# EAGLE design ftdi (EAGLE 6.4)
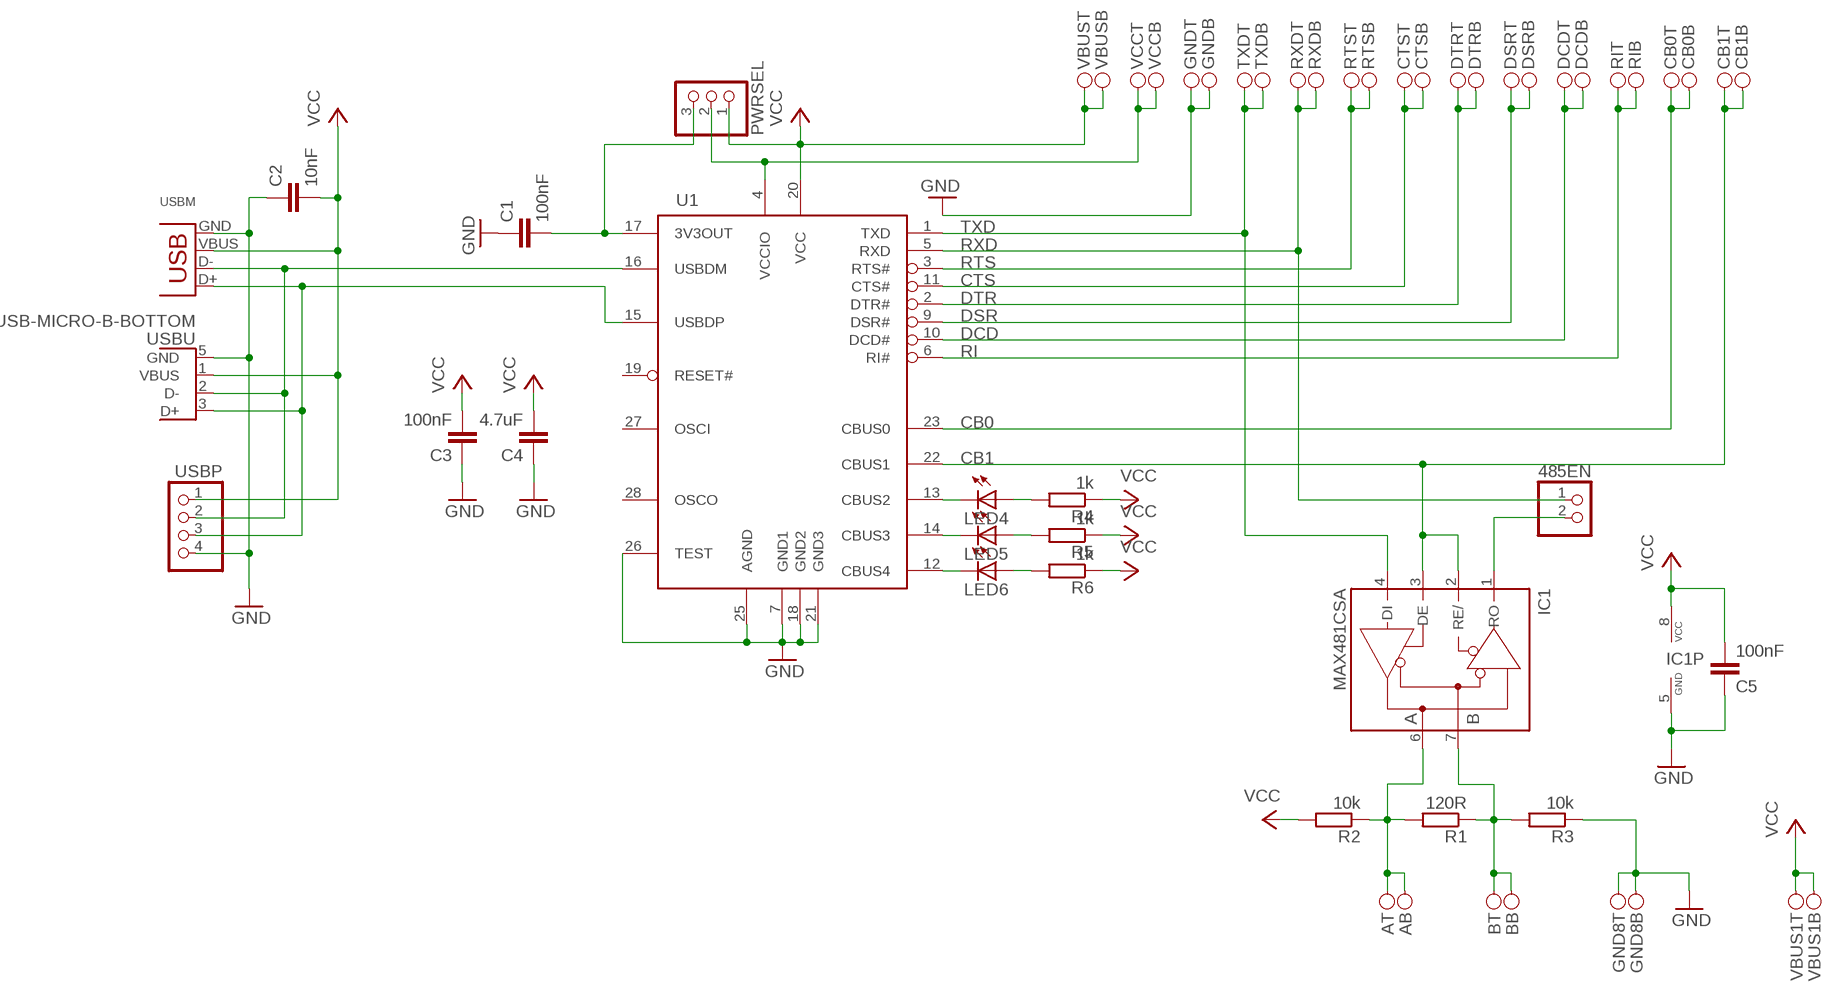
[diagram p0: schematic, sheet 1]

## Parts
485EN  PINHD-1X2/90  [1X02/90]
A  PINH2X01  [PINH2X01SMD]
B  PINH2X01  [PINH2X01SMD]
C1  100nF  C-EUC0402  [C0402]
C2  10nF  C-EUC0603  [C0603]
C3  100nF  C-EUC0402  [C0402]
C4  4.7uF  C-EUC0805K  [C0805K]
C5  100nF  C-EUC0402  [C0402]
CB0  PINH2X01  [PINH2X01SMD]
CB1  PINH2X01  [PINH2X01SMD]
CTS  PINH2X01  [PINH2X01SMD]
DCD  PINH2X01  [PINH2X01SMD]
DSR  PINH2X01  [PINH2X01SMD]
DTR  PINH2X01  [PINH2X01SMD]
GND  PINH2X01  [PINH2X01SMD]
GND8  PINH2X01  [PINH2X01SMD]
IC1  MAX481CSA  [SO08]
LED4  LEDCHIPLED_0603  [CHIPLED_0603]
LED5  LEDCHIPLED_0603  [CHIPLED_0603]
LED6  LEDCHIPLED_0603  [CHIPLED_0603]
PWRSEL  PINHD-1X3/90  [1X03/90]
R1  120R  R-EU_R0603  [R0603]
R2  10k  R-EU_R0603  [R0603]
R3  10k  R-EU_R0603  [R0603]
R4  1k  R-EU_R0603  [R0603]
R5  1k  R-EU_R0603  [R0603]
R6  1k  R-EU_R0603  [R0603]
RI  PINH2X01  [PINH2X01SMD]
RTS  PINH2X01  [PINH2X01SMD]
RXD  PINH2X01  [PINH2X01SMD]
TXD  PINH2X01  [PINH2X01SMD]
U1  FT232RL  [SSOP28DB]
USBM  USB-MB-S  [USB-MB-S]
USBP  PINHD-1X4  [1X04]
USBU  USB-MICRO-B-BOTTOM  [USB-MICRO-B-BOTTOM-MOLEX]
VBUS  PINH2X01  [PINH2X01SMD]
VBUS1  PINH2X01  [PINH2X01SMD]
VCC  PINH2X01  [PINH2X01SMD]

## Nets
3V3: C1.2 PWRSEL.3 U1.17(3V3OUT)
A: A.1 A.2 IC1.6(A) R1.2 R2.1
B: B.1 B.2 IC1.7(B) R1.1 R3.2
CB0: CB0.1 CB0.2 U1.23(CBUS0)
CB1: CB1.1 CB1.2 IC1.2(RE/) IC1.3(DE) U1.22(CBUS1)
CB2_: LED4.A R4.2
CB3_: LED5.A R5.2
CB4_: LED6.A R6.2
CBUS2_: LED4.C U1.13(CBUS2)
CBUS3_: LED5.C U1.14(CBUS3)
CBUS4_: LED6.C U1.12(CBUS4)
CTS: CTS.1 CTS.2 U1.11(CTS#)
DCD: DCD.1 DCD.2 U1.10(DCD#)
DSR: DSR.1 DSR.2 U1.9(DSR#)
DTR: DTR.1 DTR.2 U1.2(DTR#)
GND: C1.1 C2.1 C3.1 C4.1 C5.1 GND8.1 GND8.2 GND.1 GND.2 IC1.5(GND) R3.1 U1.7(GND1) U1.18(GND2) U1.21(GND3) U1.25(AGND) U1.26(TEST) USBM.GND USBP.4 USBU.5(GND)
RI: RI.1 RI.2 U1.6(RI#)
RO: 485EN.2 IC1.1(RO)
RTS: RTS.1 RTS.2 U1.3(RTS#)
RXD: 485EN.1 RXD.1 RXD.2 U1.5(RXD)
TXD: IC1.4(DI) TXD.1 TXD.2 U1.1(TXD)
USBDM: U1.16(USBDM) USBM.D- USBP.2 USBU.2(D-)
USBDP: U1.15(USBDP) USBM.D+ USBP.3 USBU.3(D+)
VCC: C2.2 C3.2 C4.2 C5.2 IC1.8(VCC) PWRSEL.1 R2.2 R4.1 R5.1 R6.1 U1.20(VCC) USBM.VBUS USBP.1 USBU.1(VBUS) VBUS1.1 VBUS1.2 VBUS.1 VBUS.2
VCCIO: PWRSEL.2 U1.4(VCCIO) VCC.1 VCC.2
Unconnected: U1.19(RESET#) U1.27(OSCI) U1.28(OSCO)

## Library data of the parts
485EN = pinhead:PINHD-1X2: PIN HEADER
A B CB0 CB1 CTS DCD DSR DTR GND GND8 RI RTS RXD TXD VBUS VBUS1 VCC = pinhead_smd:PINH2X01
C1-C5 = rcl_upravena:C-EU: CAPACITOR, European symbol
IC1 = maxim:MAX481CSA: RS485 TRANSEIVER; MF: MAXIM; MPN: MAX481CSA; OC_FARNELL: unknown; OC_NEWARK: 90C3817
LED4-LED6 = led:LED: LED OSRAM: - CHIPLED LG R971, LG N971, LY N971, LG Q971, LY Q971, LO R971, LY R971 LH N974, LH R974 LS Q976, LO Q976, LY Q976 LO Q996 - Hyper CHIPLED LW Q18S LB Q993, LB Q99A, LB R99A - SideLED LS A670, LO A670, LY A670, LG A670, LP A670 LB A673, LV A673, LT A673, LW A673 LH A674 LY A675 LS A676, LA A676, LO A676, LY A676, LW A676 LS A679, LY A679, LG A679 - Hyper Micro SIDELED® LS Y876, LA Y876, LO Y876, LY Y876 LT Y87S - SmartLED LW L88C, LW L88S LB L89C, LB L89S, LG L890 LS L89K, LO L89K, LY L89K LS L896, LA L896, LO L896, LY L896 - TOPLED LS T670, LO T670, LY T670, LG T670, LP T670 LSG T670, LSP T670, LSY T670, LOP T670, LYG T670 LG T671, LOG T671, LSG T671 LB T673, LV T673, LT T673, LW T673 LH T674 LS T676, LA T676, LO T676, LY T676, LB T676, LH T676, LSB T676, LW T676 LB T67C, LV T67C, LT T67C, LS T67K, LO T67K, LY T67K, LW E67C LS E67B, LA E67B, LO E67B, LY E67B, LB E67C, LV E67C, LT E67C LW T67C LS T679, LY T679, LG T679 LS T770, LO T770, LY T770, LG T770, LP T770 LB T773, LV T773, LT T773, LW T773 LH T774 LS E675, LA E675, LY E675, LS T675 LS T776, LA T776, LO T776, LY T776, LB T776 LHGB T686 LT T68C, LB T68C - Hyper Mini TOPLED® LB M676 - Mini TOPLED Santana® LG M470 LS M47K, LO M47K, LY M47K Source: http://www.osram.convergy.de LUXEON: - LUMILED® LXK2-PW12-R00, LXK2-PW12-S00, LXK2-PW14-U00, LXK2-PW14-V00 LXK2-PM12-R00, LXK2-PM12-S00, LXK2-PM14-U00 LXK2-PE12-Q00, LXK2-PE12-R00, LXK2-PE12-S00, LXK2-PE14-T00, LXK2-PE14-U00 LXK2-PB12-K00, LXK2-PB12-L00, LXK2-PB12-M00, LXK2-PB14-N00, LXK2-PB14-P00, LXK2-PB14-Q00 LXK2-PR12-L00, LXK2-PR12-M00, LXK2-PR14-Q00, LXK2-PR14-R00 LXK2-PD12-Q00, LXK2-PD12-R00, LXK2-PD12-S00 LXK2-PH12-R00, LXK2-PH12-S00 LXK2-PL12-P00, LXK2-PL12-Q00, LXK2-PL12-R00 Source: www.luxeon.com KINGBRIGHT: KA-3528ASYC Source: www.kingbright.com
PWRSEL = pinhead:PINHD-1X3: PIN HEADER
R1-R6 = rcl_upravena:R-EU_: RESISTOR, European symbol
U1 = ftdichip-3:FT232RL: USB UART 4th Generation USB UART (USB <-> Serial) Controller
USBM = con-usb-3:USB: USB Connectors
USBP = pinhead:PINHD-1X4: PIN HEADER
USBU = usb:USB

## Board
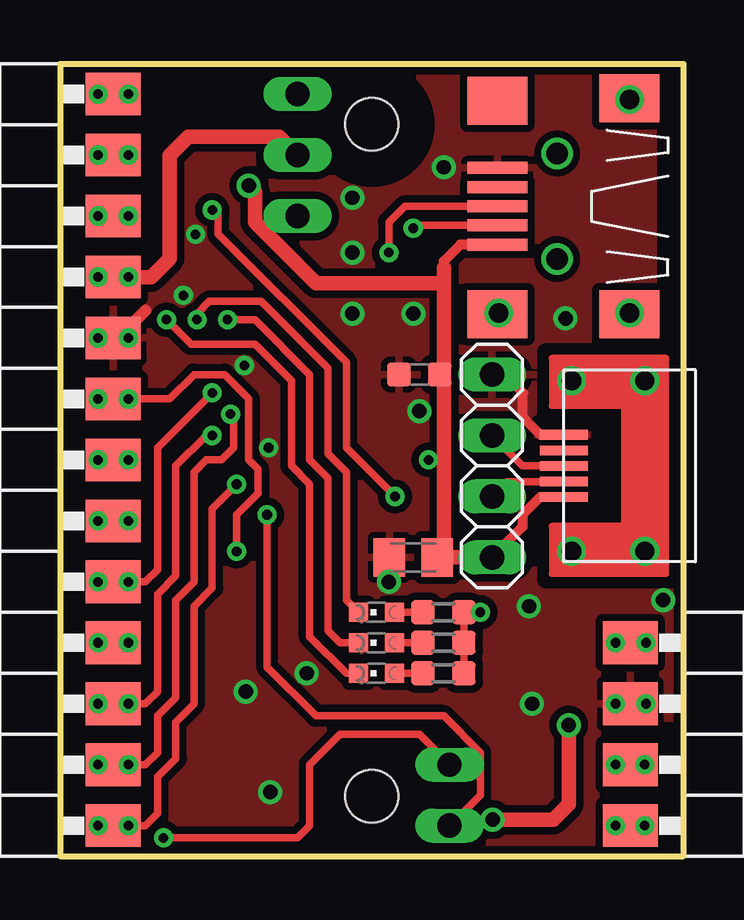
[diagram p1: board, top side]
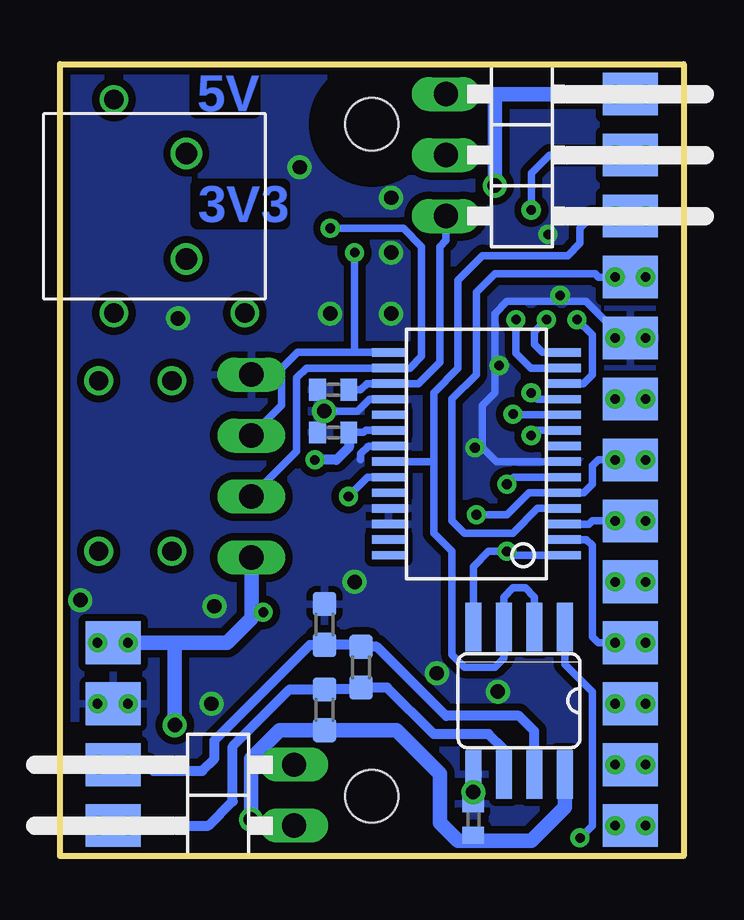
[diagram p2: board, bottom side, seen from below]

Size 26 x 33 mm. Coordinates in mm from the lower left corner, seen from the top.
Outline: 0,0 26,0 26,33 0,33 0,0
Copper layers (1*16): Top 0.035mm / dielectric 1.5mm / Bottom 0.035mm
Design rules "Design Rules - Vacha (3F) *": minimum track width 10mil, minimum drill 15mil, track to track 0.2mm, track to pad 0.2mm, pad to pad 0.2mm, via to via 0.2mm, smd to smd 0mil, copper to edge 0.15mm, drill to drill 8mil, minimum pad ring 0.2mm, minimum via ring 0.2mm, stop-mask expansion 2mil, vias tented up to drill 0.4mm, thermal gap 10mil
Holes 2.2 mm at 13,30.5 13,2.5
tRestrict: area 10.8,28.2 to 15.2,32.8; area 10.8,0.2 to 15.2,4.8; 2 lines
bRestrict: area 10.8,28.2 to 15.2,32.8; area 10.8,0.2 to 15.2,4.8; 1 lines

### Footprints (pad centres in the part's own frame; a part is rotated, then mirrored left to right if it is on the bottom)
1X02/90 = drill 1.016 long: 1 -1.27,-3.81; 2 1.27,-3.81
PINH2X01SMD = smd 1.778 x 2.286: 1 0,-2.223 | smd 1.778 x 2.286 bottom: 2 0,-2.223
C0402 = smd 0.7 x 0.9: 1 -0.65,0; 2 0.65,0
C0603 = smd 1 x 1: 1 -0.85,0; 2 0.85,0
C0805K = smd 1.3 x 1.6: 1 -1,0; 2 1,0
SO08 = smd 0.66 x 2.032: 1 -1.905,-3.073; 2 -0.635,-3.073; 3 0.635,-3.073; 4 1.905,-3.073; 5 1.905,3.073; 6 0.635,3.073; 7 -0.635,3.073; 8 -1.905,3.073
CHIPLED_0603 = smd 0.8 x 0.8: A 0,-0.75; C 0,0.75
1X03/90 = drill 1.016 long: 1 -2.54,-3.81; 2 0,-3.81; 3 2.54,-3.81
R0603 = smd 1 x 1: 1 -0.85,0; 2 0.85,0
SSOP28DB = smd 0.348 x 1.397: 1 -4.225,-3.656; 2 -3.575,-3.656; 3 -2.925,-3.656; 4 -2.275,-3.656; 5 -1.625,-3.656; 6 -0.975,-3.656; 7 -0.325,-3.656; 8 0.325,-3.656; 9 0.975,-3.656; 10 1.625,-3.656; 11 2.275,-3.656; 12 2.925,-3.656; 13 3.575,-3.656; 14 4.225,-3.656; 15 4.225,3.656; 16 3.575,3.656; 17 2.925,3.656; 18 2.275,3.656; 19 1.625,3.656; 20 0.975,3.656; 21 0.325,3.656; 22 -0.325,3.656; 23 -0.975,3.656; 24 -1.625,3.656; 25 -2.275,3.656; 26 -2.925,3.656; 27 -3.575,3.656; 28 -4.225,3.656
USB-MB-S = smd 2.5 x 0.5: D+ 2.5,0; D- 2.5,0.8; GND 2.5,-1.6; ID 2.5,-0.8; VBUS 2.5,1.6 | smd 2.5 x 2: P$1 -3,-4.5; P$2 -3,4.5; P$3 2.5,-4.4; P$4 2.5,4.5 | drill 0.9: P$5 0,2.2; P$6 0,-2.2
1X04 = drill 1.016 long: 1 -3.81,0; 2 -1.27,0; 3 1.27,0; 4 3.81,0
USB-MICRO-B-BOTTOM-MOLEX = smd 2 x 0.4: 1 5,1.3; 2 5,0.65; 3 5,0; 4 5,-0.65; 5 5,-1.3

### Placement (x,y rotation side)
485EN  20.05,2.54 90 bottom
A  26,1.27 270 top
B  26,3.81 270 top
C1  14.61,19.43 0 bottom
C2  14.99,20.07 0 top
C3  14.61,17.65 0 bottom
C4  14.73,12.45 0 top
C5  8.76,1.52 270 bottom
CB0  0,29.21 90 top
CB1  0,26.67 90 top
CTS  0,11.43 90 top
DCD  0,3.81 90 top
DSR  0,6.35 90 top
DTR  0,8.89 90 top
GND  0,21.59 90 top
GND8  26,6.35 270 top
IC1  6.86,6.48 180 bottom
LED4  13.19,8.89 90 top
LED5  13.19,10.16 90 top
LED6  13.19,7.62 90 top
PWRSEL  6.1,29.21 270 bottom
R1  13.45,7.87 270 bottom
R2  14.97,6.1 270 bottom
R3  14.97,9.65 270 bottom
R4  15.99,8.89 180 top
R5  15.99,10.16 180 top
R6  15.99,7.62 180 top
RI  0,1.27 90 top
RTS  0,13.97 90 top
RXD  0,16.51 90 top
TXD  0,19.05 90 top
U1  8.64,16.76 90 bottom
USBM  20.73,27.08 180 top
USBP  18.02,16.26 90 top
USBU  26,16.26 180 top
VBUS  0,31.75 90 top
VBUS1  26,8.89 270 top
VCC  0,24.13 90 top

### Tracks (layer width: path | path; a pad name or v marks a point on that pad's centre or on a via)
3V3
  Bottom 0.305: PWRSEL.3 9.91,25.65 10.16,25.4 10.16,20.57 11.04,19.69 U1.17 13.2,19.69 13.46,19.43 C1.2
A  (via drill 0.4)
  Top 0.305: A.2 v24.38,1.27
  Bottom 0.305: v23.16,1.27 A.2 v24.38,1.27
  Bottom 0.406: v23.16,1.27 19.81,1.27 18.8,2.29 18.8,4.57 16.42,6.95 R2.1 13.52,6.95 R1.2 12.36,7.02 10.41,5.08 8.13,5.08 7.49,4.45 IC1.6
B  (via drill 0.4)
  Top 0.305: v24.38,3.81 B.2
  Bottom 0.305: v24.38,3.81 B.2 v23.16,3.81
  Bottom 0.406: v23.16,3.81 22.35,3.81 22.1,3.56 20.07,3.56 19.56,4.06 19.56,4.83 15.58,8.8 R3.2 13.52,8.8 R1.1 12.79,8.72 9.91,5.84 6.86,5.84 6.22,5.21 IC1.7
CB0  (via drill 0.4)
  Top 0.305: v13.97,14.99 11.94,17.02 11.94,20.57 6.6,25.91 6.6,26.67 v6.35,26.92
  Top 0.406: CB0.2 v1.59,29.21 v2.86,29.21
  Bottom 0.305: v6.35,26.92 6.35,28.45 5.59,29.21 v2.86,29.21 | U1.23 13.17,15.79 v13.97,14.99
  Bottom 0.406: CB0.2 v1.59,29.21
CB1  (via drill 0.4)
  Top 0.406: CB1.2 v1.59,26.67 v2.86,26.67
  Bottom 0.305: 9.14,7.87 9.65,8.38 | 9.65,8.38 9.65,12.7 10.41,13.46 10.41,16.51 | 10.41,16.51 10.41,19.3 9.4,20.32 9.4,24 8.38,25.02 4.83,25.02 4.32,25.53 4.32,26.16 3.81,26.67 v2.86,26.67 | 9.14,7.87 7.87,7.87 7.49,8.26 IC1.3 7.49,10.79 7.11,11.18 6.6,11.18 6.22,10.79 IC1.2 | U1.22 10.41,16.44 10.41,16.51 | 9.14,7.87 9.65,8.38
  Bottom 0.406: v1.59,26.67 CB1.2
CB2_
  Top 0.305: LED4.A R4.2
CB3_
  Top 0.305: LED5.A R5.2
CB4_
  Top 0.305: LED6.A R6.2
CBUS2_  (via drill 0.4)
  Top 0.305: v6.99,22.35 8.13,22.35 10.41,20.07 10.41,16.51 11.18,15.75 11.18,10.92 11.18,9.4 11.68,8.89 LED4.C
  Bottom 0.305: U1.13 6.37,20.34 6.99,20.95 v6.99,22.35
CBUS3_  (via drill 0.4)
  Top 0.305: v5.71,22.35 5.71,22.61 6.22,23.11 8.38,23.11 11.18,20.32 11.18,16.76 11.94,16 11.94,11.18 11.94,10.66 LED5.C
  Bottom 0.305: U1.14 5.88,20.99 6.22,21.34 6.22,21.84 v5.71,22.35
CBUS4_  (via drill 0.4)
  Top 0.305: v4.45,22.35 5.46,21.34 8.13,21.34 9.65,19.81 9.65,16.26 10.41,15.49 10.41,10.67 10.41,9.14 11.94,7.62 LED6.C
  Bottom 0.305: v4.45,22.35 3.81,21.72 3.81,20.07 4.19,19.69 U1.12
CTS  (via drill 0.4)
  Top 0.305: v2.86,11.43 3.56,11.43 4.06,11.94 4.06,17.02 5.84,18.8 v6.35,19.3
  Top 0.406: CTS.2 v1.59,11.43 v2.86,11.43
  Bottom 0.305: v6.35,19.3 6.08,19.04 U1.11
  Bottom 0.406: CTS.2 v1.59,11.43
DCD  (via drill 0.4)
  Top 0.305: v2.86,3.81 3.56,3.81 4.06,4.32 4.06,5.84 4.83,6.6 4.83,10.67 5.59,11.43 5.59,16 6.1,16.51 6.73,16.51 7.24,17.02 7.24,18.29 v7.11,18.41
  Top 0.406: DCD.2 v1.59,3.81 v2.86,3.81
  Bottom 0.305: v7.11,18.41 7.14,18.39 U1.10
  Bottom 0.406: DCD.2 v1.59,3.81
DSR  (via drill 0.4)
  Top 0.305: v2.86,6.35 3.56,6.35 4.06,6.86 4.06,10.92 4.83,11.68 4.83,16.26 6.1,17.53 v6.35,17.53
  Top 0.406: DSR.2 v1.59,6.35 v2.86,6.35
  Bottom 0.305: v6.35,17.53 6.14,17.74 U1.9
  Bottom 0.406: DSR.2 v1.59,6.35
DTR  (via drill 0.4)
  Top 0.406: DTR.2 v1.59,8.89 v2.86,8.89
  Bottom 0.305: U1.2 4.04,13.19 3.81,12.95 3.81,9.14 3.56,8.89 v2.86,8.89
  Bottom 0.406: v1.59,8.89 DTR.2
GND  (via drill 0.4, 0.6)
  Top 0.406: USBU.5 20.04,17.56 19.3,18.29 19.3,19.3 18.54,20.07 USBP.4
  Top 0.508: 3.05,22.23 3.56,22.73
  Bottom 0.305: U1.7 7.8,16.44 8.38,17.02 8.38,18.8 7.87,19.3 7.87,22.61 7.37,23.11 4.06,23.11 3.05,22.1 3.05,21.78 v2.86,21.59 | U1.18 13.09,19.04 13.59,18.54 v14.99,18.54 | U1.21 13.14,17.09 13.46,16.76 13.46,16.51
  Bottom 0.61: C5.1 IC1.5
  other vias: 1.59,21.59 24.43,6.35 23.16,6.35 16,28.7 12.19,25.15 12.19,22.61 13.72,11.43 7.68,20.45 25.15,10.67 21.08,22.41 14.73,22.61 10.29,7.62 8.7,17.02 7.75,6.86 8.76,2.67 19.68,6.35 5.65,25.91 5.14,23.37 12.19,27.43 19.56,10.41
  pour Top (isolate 0.305): 1.27,0 1.27,33 26,33 26,0
  pour Bottom (isolate 0.305): 26,33 26,0 1.02,0 1.27,33
N$1  (via drill 0.8)
  other vias: 24.38,19.81
N$2  (via drill 0.8)
  other vias: 21.34,19.81
N$3  (via drill 0.8)
  other vias: 21.34,12.7
N$4  (via drill 0.8)
  other vias: 24.38,12.7
N$6  (via drill 0.8)
  other vias: 23.75,31.52
N$7  (via drill 0.8)
  other vias: 23.75,22.63
N$8  (via drill 0.8)
  other vias: 18.29,22.63
RI  (via drill 0.4)
  Top 0.305: v2.86,1.27 3.56,1.27 4.06,1.78 4.06,3.3 4.83,4.06 4.83,5.59 5.59,6.35 5.59,10.41 6.35,11.18 6.35,14.48 v7.37,15.49
  Top 0.406: v1.59,1.27 RI.2 v2.86,1.27
  Bottom 0.305: v7.37,15.49 7.07,15.79 U1.6
  Bottom 0.406: RI.2 v1.59,1.27
RO  (via drill 0.4)
  Top 0.305: 485EN.2 16.24,3.83 14.99,5.08 11.68,5.08 10.41,3.81 10.41,1.27 9.91,0.76 v4.32,0.76
  Bottom 0.305: IC1.1 4.95,8 3.81,6.86 3.81,1.27 v4.32,0.76
RTS  (via drill 0.4)
  Top 0.406: RTS.2 v1.59,13.97 v2.86,13.97
  Bottom 0.305: U1.3 3.94,13.84 3.81,13.97 v2.86,13.97
  Bottom 0.406: v1.59,13.97 RTS.2
RXD  (via drill 0.4)
  Top 0.305: 485EN.1 16.26,1.27 17.53,2.54 17.53,4.32 16,5.84 10.67,5.84 8.64,7.87 v8.64,14.22
  Top 0.406: v1.59,16.51 RXD.2 2.54,16.51 v2.86,16.51
  Bottom 0.305: v2.86,16.51 3.56,16.51 3.81,16.26 3.81,15.49 4.17,15.14 U1.5 6.45,15.14 7.37,14.22 v8.64,14.22
  Bottom 0.406: RXD.2 v1.59,16.51
TXD  (via drill 0.4)
  Top 0.305: v2.86,19.05 4.57,19.05 5.59,20.07 6.86,20.07 7.87,19.05 7.87,16.51 8.26,16.13 8.26,15.11 7.37,14.22 v7.37,12.7
  Top 0.406: TXD.2 v1.59,19.05 v2.86,19.05
  Bottom 0.305: U1.1 7.21,12.54 v7.37,12.7 8.13,12.7 8.76,12.06 IC1.4
  Bottom 0.406: v1.59,19.05 TXD.2
USBDM  (via drill 0.4)
  Top 0.305: USBU.2 18.64,15.61 USBP.2 | USBM.D- 14.85,26.28 v14.73,26.16
  Bottom 0.305: USBP.2 16.13,16.88 16.13,19.94 15.73,20.34 U1.16 11.41,20.34 10.92,20.83 10.92,25.4 11.68,26.16 v14.73,26.16
USBDP  (via drill 0.4)
  Top 0.305: USBU.3 19.29,16.26 USBP.3 | USBM.D+ 14.38,27.08 13.72,26.42 v13.72,25.15
  Bottom 0.305: USBP.3 18.02,17.54 16.76,18.8 16.76,20.32 16.09,20.99 13.72,20.99 | 13.72,20.99 U1.15 | v13.72,25.15 13.72,20.99
VCC  (via drill 0.4, 0.6)
  Top 0.305: v23.16,8.89 VBUS1.2 | R6.1 R4.1 R5.1 v17.53,10.16
  Top 0.406: VBUS.2 v1.59,31.75 v2.86,31.75 | USBU.1 20.02,14.96 19.29,14.22 19.29,13.72 USBP.1 | USBM.VBUS 16.69,25.48 16,24.79 16,24.51 | v15.37,16.51 16,16.51
  Top 0.61: v18.03,1.52 20.57,1.52 21.21,2.16 v21.21,5.46 | v7.87,27.94 8.13,27.69 8.13,26.42 10.67,23.88 14.99,23.88 16,23.88 | USBP.1 16.76,12.45 16.26,12.45 16,12.45 | 16,12.45 16,16.51 16,20.07 | 16,20.07 16,23.88 | 16,23.88 16,24.51 | C4.2 15.75,12.45 16,12.45 | C2.2 16,20.07
  Bottom 0.254: C5.2 8.76,0.76 8.64,0.64
  Bottom 0.305: v24.43,8.89 VBUS1.2 v23.16,8.89 | U1.20 13.25,17.74 13.34,17.65 C3.2 | v17.53,10.16 18.02,10.16
  Bottom 0.406: v1.59,31.75 VBUS.2 | C3.2 13.96,17.03 14.48,16.51 v15.37,16.51
  Bottom 0.61: v23.16,8.89 21.21,8.89 | 21.21,8.89 19.03,8.89 18.02,9.91 18.02,10.16 USBP.1 | IC1.8 4.95,2.03 6.35,0.64 8.64,0.64 8.89,0.64 9.4,0.64 10.16,1.4 10.16,3.43 11.98,5.25 R2.2 16.85,5.25 18.03,4.06 v18.03,1.52 | v21.21,5.46 21.21,8.89 | PWRSEL.1 7.87,31.75 | 7.87,31.75 v7.87,27.94 | v2.86,31.75 7.87,31.75
VCCIO  (via drill 0.4)
  Top 0.406: VCC.2 v1.59,24.13 v2.86,24.13
  Top 0.61: v2.86,24.13 3.81,24.13 4.57,24.89 4.57,29.21 5.33,29.97 9.14,29.97 PWRSEL.2
  Bottom 0.305: U1.4 6.08,14.49 7.11,13.46 9.14,13.46 9.65,13.97 9.65,19.05 8.64,20.07 8.64,23.5 7.87,24.26 3.68,24.26 3.56,24.13 v2.86,24.13
  Bottom 0.406: VCC.2 v1.59,24.13

### Text on the board
Bottom: 5V | 3V3
Document: VBUS | CB0 | 5V | CB1 | 3V3 | VCC | GND | VBUS | TXD | FTDI | DP | RXD | v5 | DM | GND | RTS | CTS | PWR | DTR | TXD | VBUS | DSR | RXD | GND | DCD | B | RI | A